# EasyEDA schematic 1-Schematic_ArduinoMini.json
TITLE: Sheet_1; REV: 1.0; Date: 2023-12-20; Sheet: 1/1; Drawn By: mem; Company: Your Company
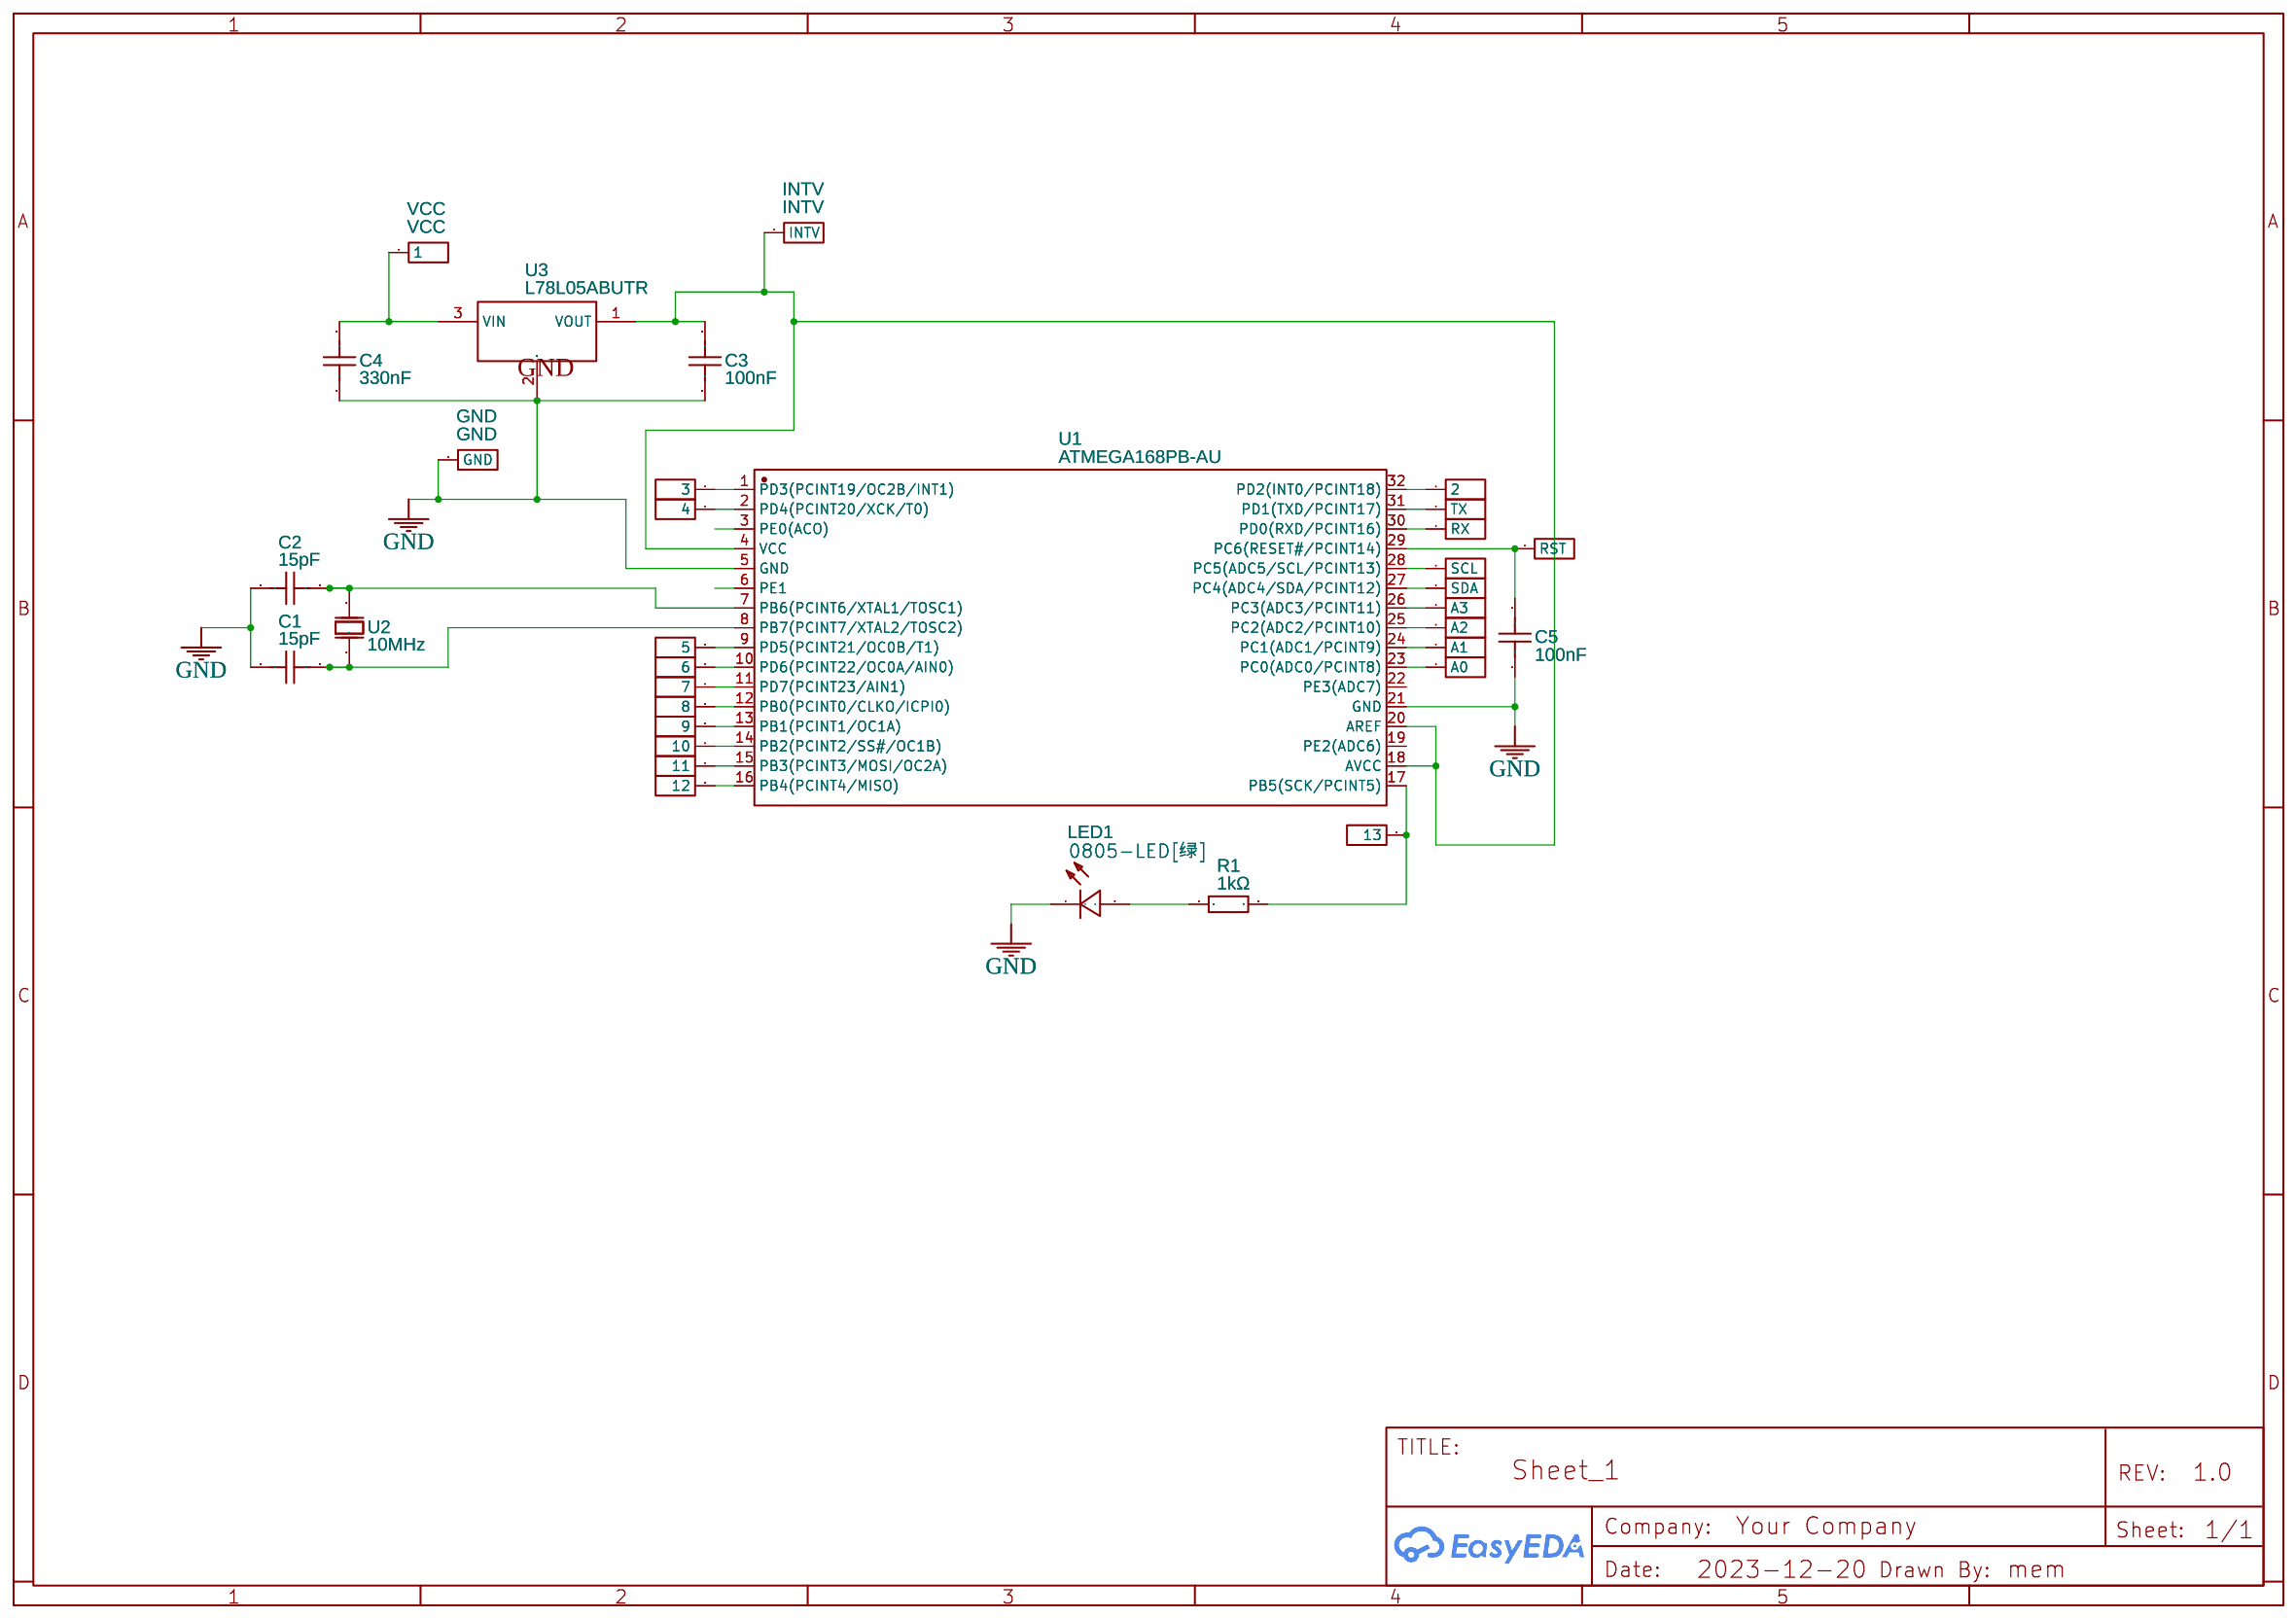
[diagram p0: schematic sheet]

## Parts
2  2  [HDR-M-2.54_1X1]
3  3  [HDR-M-2.54_1X1]
4  4  [HDR-M-2.54_1X1]
5  5  [HDR-M-2.54_1X1]
6  6  [HDR-M-2.54_1X1]
7  7  [HDR-M-2.54_1X1]
8  8  [HDR-M-2.54_1X1]
9  9  [HDR-M-2.54_1X1]
10  10  [HDR-M-2.54_1X1]
11  11  [HDR-M-2.54_1X1]
12  12  [HDR-M-2.54_1X1]
13  13  [HDR-M-2.54_1X1]
A0  A0  [HDR-M-2.54_1X1]
A1  A1  [HDR-M-2.54_1X1]
A2  A2  [HDR-M-2.54_1X1]
A3  A3  [HDR-M-2.54_1X1]
C1  15pF  [C0805]
C2  15pF  [C0805]
C3  100nF  [C0805]
C4  330nF  [C0805]
C5  100nF  [C0805]
GND  GND  [HDR-M-2.54_1X1]
INTV  INTV  [HDR-M-2.54_1X1]
LED1  0805-LED[绿]  [LED0805-RD_GREEN]
R1  1kΩ  [R0805]
RST  RST  [HDR-M-2.54_1X1]
RX  RX  [HDR-M-2.54_1X1]
SCL  SCL  [HDR-M-2.54_1X1]
SDA  SDA  [HDR-M-2.54_1X1]
TX  TX  [HDR-M-2.54_1X1]
U1  ATMEGA168PB-AU  [TQFP-32_L7.0-W7.0-P0.80-LS9.0-BL]
U2  10MHz  [CRYSTAL-TH_L10.8-W4.5-P4.88]
U3  L78L05ABUTR  [SOT-89-3_L4.5-W2.5-P1.50-LS4.2-TL]
VCC  VCC  [HDR-M-2.54_1X1]

## Library data of the parts
2-13 A0-A3 GND INTV RST RX SCL SDA TX VCC = HDR-M-2.54_1x1: Supplier Part: C81276; Supplier: LCSC; Contributor: LCEDA_Lib
C1 C2 = C0805C150K3HAC7800: Contributor: lcsc; Supplier: LCSC; Supplier Part: C2205093; Manufacturer: KEMET(基美); JLCPCB Part Class: Extended Part
C3 C5 = 08051C104KAZ2A: Contributor: LCSC; Supplier: LCSC; Supplier Part: C597291; Manufacturer: Kyocera AVX; JLCPCB Part Class: Extended Part
C4 = CC0805KKX7R7BB334: Contributor: LCSC; Supplier: LCSC; Supplier Part: C113844; Manufacturer: YAGEO(国巨); JLCPCB Part Class: Extended Part
LED1 = 0805-LED[绿]: Contributor: LCSC; Supplier: LCSC; Supplier Part: C9900003727; Manufacturer: null; JLCPCB Part Class: Extended Part
R1 = 0805W8F1001T5E: Supplier: LCSC; Manufacturer: UNI-ROYAL(厚声); Supplier Part: C17513; JLCPCB Part Class: Basic Part
U1 = ATMEGA168PB-AU: Contributor: LCSC; Supplier: LCSC; Supplier Part: C194438; Manufacturer: MICROCHIP(美国微芯); JLCPCB Part Class: Extended Part
U2 = ATS100B-E: Contributor: lcsc; Supplier: LCSC; Supplier Part: C1669693; Manufacturer: CTS(西迪斯); JLCPCB Part Class: Extended Part
U3 = L78L05ABUTR: Supplier: LCSC; Manufacturer: ST(意法半导体); Supplier Part: C42738; JLCPCB Part Class: Extended Part

## Nets
GND: C1.1 C2.1 C3.1 C4.1 C5.1 GND.1(GND) LED1.1(-) U1.5(GND) U1.21(GND) U3.2(GND)
Net-(2-1): 2.1(2) U1.32(PD2(INT0/PCINT18))
Net-(3-1): 3.1(3) U1.1(PD3(PCINT19/OC2B/INT1))
Net-(4-1): 4.1(4) U1.2(PD4(PCINT20/XCK/T0))
Net-(5-1): 5.1(5) U1.9(PD5(PCINT21/OC0B/T1))
Net-(6-1): 6.1(6) U1.10(PD6(PCINT22/OC0A/AIN0))
Net-(7-1): 7.1(7) U1.11(PD7(PCINT23/AIN1))
Net-(8-1): 8.1(8) U1.12(PB0(PCINT0/CLKO/ICPI0))
Net-(9-1): 9.1(9) U1.13(PB1(PCINT1/OC1A))
Net-(10-1): 10.1(10) U1.14(PB2(PCINT2/SS#/OC1B))
Net-(11-1): 11.1(11) U1.15(PB3(PCINT3/MOSI/OC2A))
Net-(12-1): 12.1(12) U1.16(PB4(PCINT4/MISO))
Net-(13-1): 13.1(13) R1.2 U1.17(PB5(SCK/PCINT5))
Net-(A0-1): A0.1(A0) U1.23(PC0(ADC0/PCINT8))
Net-(A1-1): A1.1(A1) U1.24(PC1(ADC1/PCINT9))
Net-(A2-1): A2.1(A2) U1.25(PC2(ADC2/PCINT10))
Net-(A3-1): A3.1(A3) U1.26(PC3(ADC3/PCINT11))
Net-(C1-2): C1.2 U1.8(PB7(PCINT7/XTAL2/TOSC2)) U2.1
Net-(C2-2): C2.2 U1.7(PB6(PCINT6/XTAL1/TOSC1)) U2.2
Net-(C3-2): C3.2 INTV.1(INTV) U1.4(VCC) U1.18(AVCC) U1.20(AREF) U3.1(VOUT)
Net-(C4-2): C4.2 U3.3(VIN) VCC.1
Net-(C5-2): C5.2 RST.1(RST) U1.29(PC6(RESET#/PCINT14))
Net-(LED1-2): LED1.2(+) R1.1
Net-(RX-1): RX.1(RX) U1.30(PD0(RXD/PCINT16))
Net-(SCL-1): SCL.1(SCL) U1.28(PC5(ADC5/SCL/PCINT13))
Net-(SDA-1): SDA.1(SDA) U1.27(PC4(ADC4/SDA/PCINT12))
Net-(TX-1): TX.1(TX) U1.31(PD1(TXD/PCINT17))

Not connected (* = marked no-connect by the designer): U1 3(PE0(ACO)) 6(PE1) 19(PE2(ADC6)) 22(PE3(ADC7))
